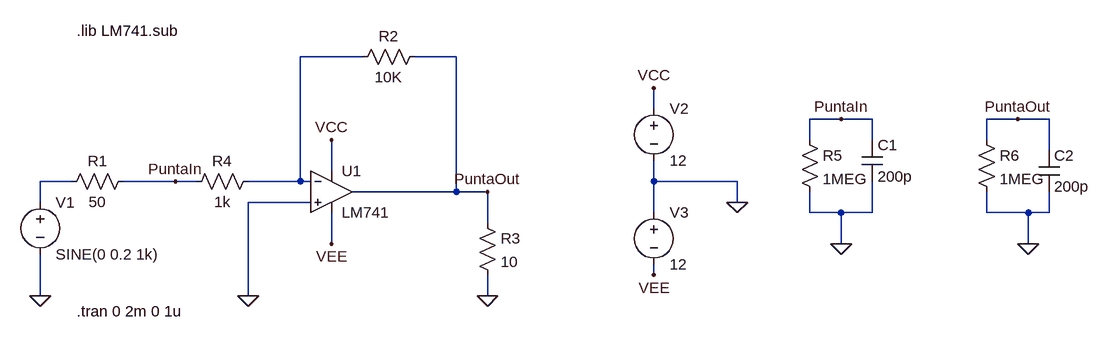
[diagram p0: schematic A1Aultimapreg.asc]
A1Aultimapreg.asc, the LTspice schematic file:
Version 4
SHEET 1 1304 680
WIRE 176 16 80 16
WIRE 320 16 256 16
WIRE 624 96 624 64
WIRE 912 112 864 112
WIRE 960 112 912 112
WIRE 1184 112 1136 112
WIRE 1232 112 1184 112
WIRE 864 144 864 112
WIRE 960 144 960 112
WIRE 1136 144 1136 112
WIRE 1232 160 1232 112
WIRE 128 192 128 144
WIRE -272 208 -320 208
WIRE -112 208 -192 208
WIRE -80 208 -112 208
WIRE 80 208 80 16
WIRE 80 208 0 208
WIRE 96 208 80 208
WIRE 624 208 624 176
WIRE 752 208 624 208
WIRE 320 224 320 16
WIRE 320 224 160 224
WIRE 368 224 320 224
WIRE -320 240 -320 208
WIRE 96 240 0 240
WIRE 752 240 752 208
WIRE 624 256 624 208
WIRE 864 256 864 224
WIRE 912 256 864 256
WIRE 960 256 960 208
WIRE 960 256 912 256
WIRE 1136 256 1136 224
WIRE 1200 256 1136 256
WIRE 1232 256 1232 224
WIRE 1232 256 1200 256
WIRE 368 272 368 224
WIRE 128 304 128 256
WIRE 912 304 912 256
WIRE 1200 304 1200 256
WIRE 624 352 624 336
WIRE -320 384 -320 320
WIRE 0 384 0 240
WIRE 368 384 368 352
FLAG 0 384 0
FLAG -320 384 0
FLAG 368 384 0
FLAG 752 240 0
FLAG 624 64 VCC
FLAG 624 352 VEE
FLAG 128 144 VCC
FLAG 128 304 VEE
FLAG 912 304 0
FLAG 912 112 PuntaIn
FLAG -112 208 PuntaIn
FLAG 1200 304 0
FLAG 1184 112 PuntaOut
FLAG 368 224 PuntaOut
SYMBOL Opamps\\opamp2 128 160 R0
SYMATTR InstName U1
SYMATTR Value LM741
SYMBOL res 272 0 R90
WINDOW 0 0 56 VBottom 2
WINDOW 3 32 56 VTop 2
SYMATTR InstName R2
SYMATTR Value 10K
SYMBOL voltage -320 224 R0
WINDOW 123 0 0 Left 2
WINDOW 39 0 0 Left 2
SYMATTR InstName V1
SYMATTR Value SINE(0 0.2 1k)
SYMBOL res 352 256 R0
SYMATTR InstName R3
SYMATTR Value 10
SYMBOL voltage 624 240 R0
SYMATTR InstName V3
SYMATTR Value 12
SYMBOL voltage 624 80 R0
SYMATTR InstName V2
SYMATTR Value 12
SYMBOL res -176 192 R90
WINDOW 0 0 56 VBottom 2
WINDOW 3 32 56 VTop 2
SYMATTR InstName R1
SYMATTR Value 50
SYMBOL res -96 224 R270
WINDOW 0 32 56 VTop 2
WINDOW 3 0 56 VBottom 2
SYMATTR InstName R4
SYMATTR Value 1k
SYMBOL res 848 128 R0
SYMATTR InstName R5
SYMATTR Value 1MEG
SYMBOL cap 944 144 R0
SYMATTR InstName C1
SYMATTR Value 200p
SYMBOL res 1120 128 R0
SYMATTR InstName R6
SYMATTR Value 1MEG
SYMBOL cap 1216 160 R0
SYMATTR InstName C2
SYMATTR Value 200p
TEXT -264 -24 Left 2 !.lib LM741.sub
TEXT -264 408 Left 2 !.tran 0 2m 0 1u

The netlist it stands for:
* A1Aultimapreg.asc
XU1 0 N001 VCC VEE PuntaOut LM741  ; pins In+ In- V+ V- OUT
R2 PuntaOut N001 10K
V1 N002 0 SINE(0 0.2 1k)
R3 PuntaOut 0 10
V3 0 VEE 12
V2 VCC 0 12
R1 PuntaIn N002 50
R4 PuntaIn N001 1k
R5 PuntaIn 0 1MEG
C1 PuntaIn 0 200p
R6 PuntaOut 0 1MEG
C2 PuntaOut 0 200p
.lib LM741.sub
.tran 0 2m 0 1u
.backanno
.end